# EAGLE design Stirplate (EAGLE 9.6.2)
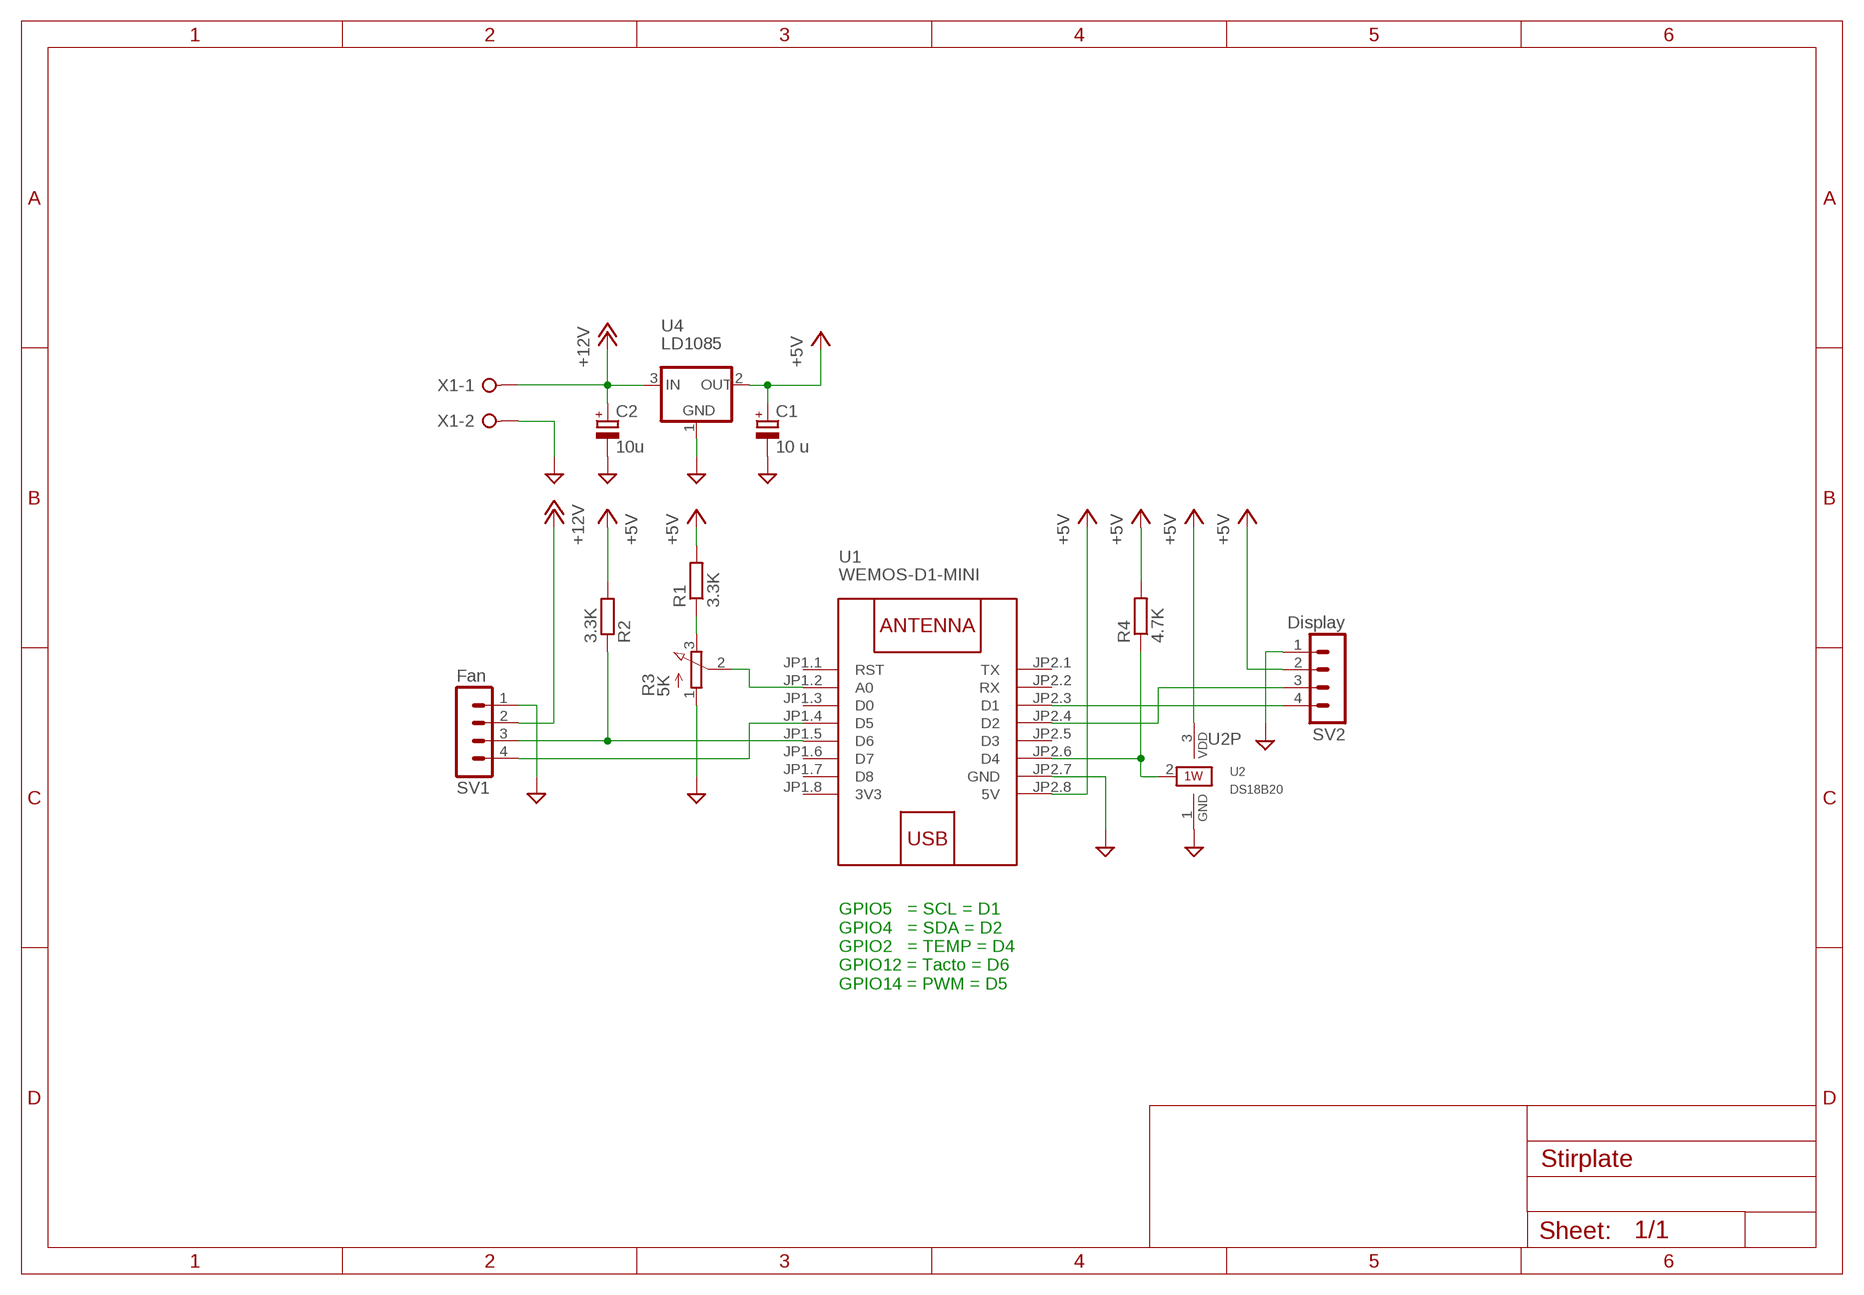
[diagram p0: schematic, sheet 1]

## Parts
C1  10 u  CPOL-EUE2.5-5  [E2,5-5]
C2  10u  CPOL-EUE2.5-5  [E2,5-5]
R1  3.3K  R-EU_0207/10  [0207/10]
R2  3.3K  R-EU_0207/10  [0207/10]
R3  5K  3RP/1610N  [3RP/1610N]
R4  4.7K  R-EU_0207/10  [0207/10]
SV1  Fan  MA04-1  [MA04-1]
SV2  Display  MA04-1  [MA04-1]
U1  WEMOS-D1-MINI  [WEMOS-D1-MINI]
U2  DS18B20  [TO92-]
U4  PMX42_LD1086VXX-H  [PMX42_TO220-NH]
X1  W237-02P  [W237-132]

## Nets
1W: R4.1 U1.JP2.6(D4) U2.2(1W)
+5V: C1.+ R1.2 R2.2 R4.2 SV2.2 U1.JP2.8(5V) U2.3(VDD) U4.2(OUT)
+12V: C2.+ SV1.2 U4.3(IN) X1.1
GND: C1.- C2.- R3.1(A) SV1.1 SV2.1 U1.JP2.7(GND) U2.1(GND) U4.1(GND) X1.2
N$1: R3.2(S) U1.JP1.2(A0)
N$2: R1.1 R3.3(E)
N$4: R2.1 SV1.3 U1.JP1.5(D6)
N$5: SV1.4 U1.JP1.4(D5)
N$8: SV2.3 U1.JP2.4(D2)
N$9: SV2.4 U1.JP2.3(D1)
Unconnected: U1.JP1.1(RST) U1.JP1.3(D0) U1.JP1.6(D7) U1.JP1.7(D8) U1.JP2.1(TX) U1.JP2.2(RX) U1.JP2.5(D3)

## Notes on the sheet
- GPIO5   = SCL = D1
  GPIO4   = SDA = D2
  GPIO2   = TEMP = D4
  GPIO12 = Tacto = D6
  GPIO14 = PWM = D5

## Power pins joined to a net without a drawn wire
3V3: U1.JP1.8(3V3)

## Library data of the parts
C1 C2 = rcl:CPOL-EU: POLARIZED CAPACITOR, European symbol
R1 R2 R4 = rcl:R-EU_: RESISTOR, European symbol
R3 = pot:3RP/1610N: 16mm Potentiometer one level Source: http://www.alphapotentiometers.net/html/16mm_pot_2.html
SV1 SV2 = con-lstb:MA04-1: PIN HEADER; OC_FARNELL: unknown; OC_NEWARK: unknown
U1 = diy-modules:WEMOS-D1-MINI: WEMOS D1 mini: Mini Wi-Fi Board based on ESP-8266 device More details can be found here: https://www.wemos.cc/product/d1-mini.html Click here to find device on ebay.com <http://www.ebay.com/sch/wemos+d1+mini+nodemcu>
U2 = 1wire:DS18B20: Programmable Resolution Digital Thermometer This chip provides a onewire thermosensor with approx. 0.5°C accuracy. A programmable over/undertemperure alarm is available. The precision can be set from 9..12 bits. Notes: Vdd must be applied for accurate measurements at low temperatures, as the parasite power circuit otherwise heats the sensor. If parasite power is used, Vdd has to be connected to GND. The DS1822 is a low-cost thermometer chip, the DS18S20 is similar to the DS18B20, but with 9 Bit precision only. Author: Jan Kandziora <jjj@gmx.de>
U4 = LinkedLibrary52101:PMX42_LD1086: LDO Regulator LD1086 series; ID: LD1085
X1 = con-wago-508:W237-02P: WAGO SREW CLAMP; OC_FARNELL: unknown; OC_NEWARK: unknown

## Board
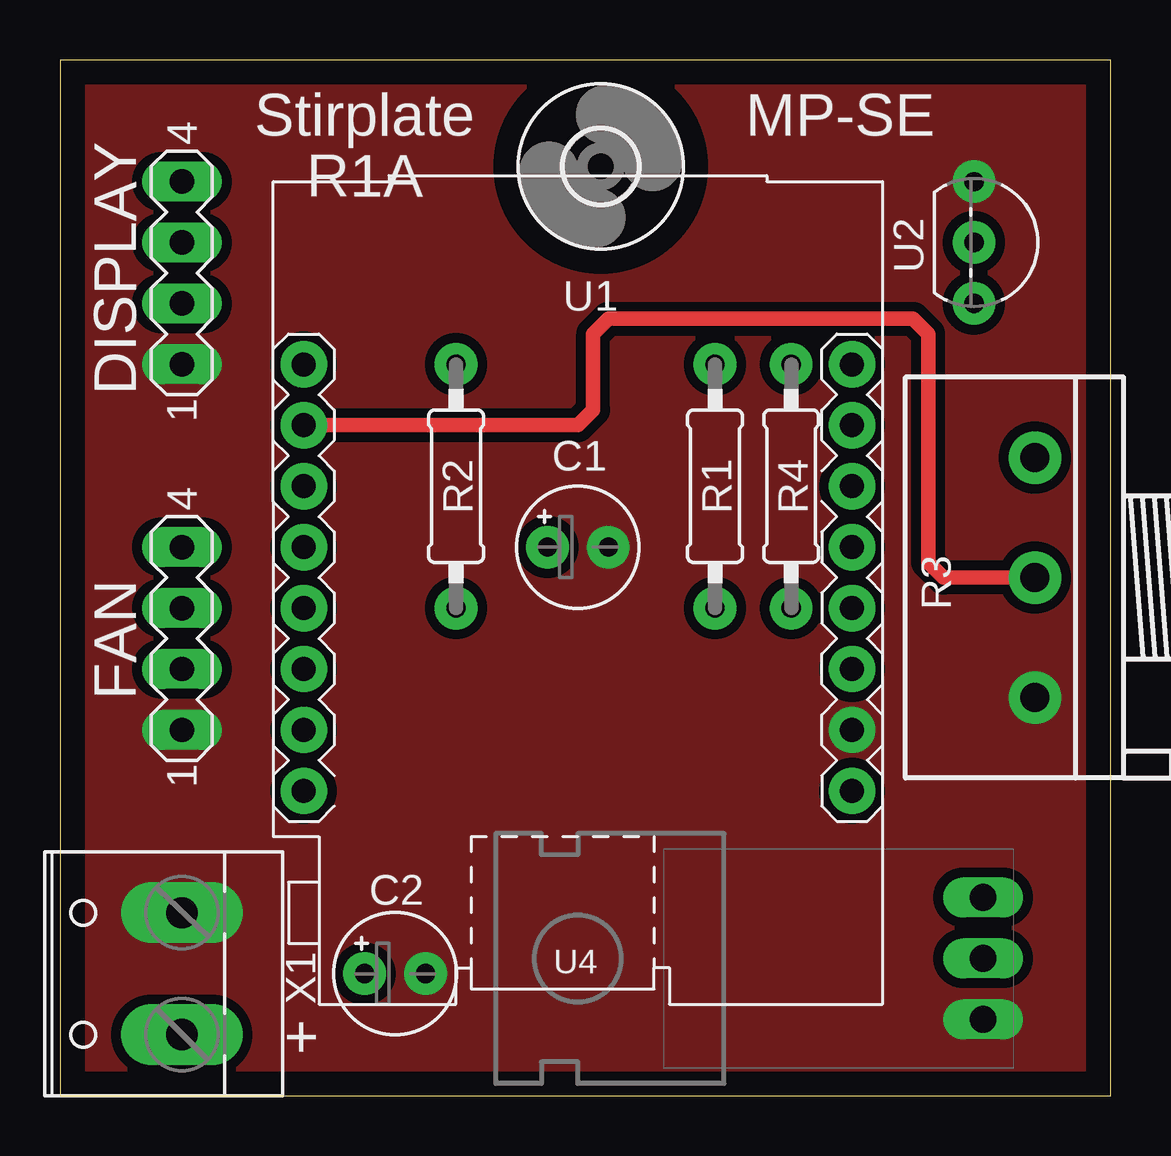
[diagram p1: board, top side]
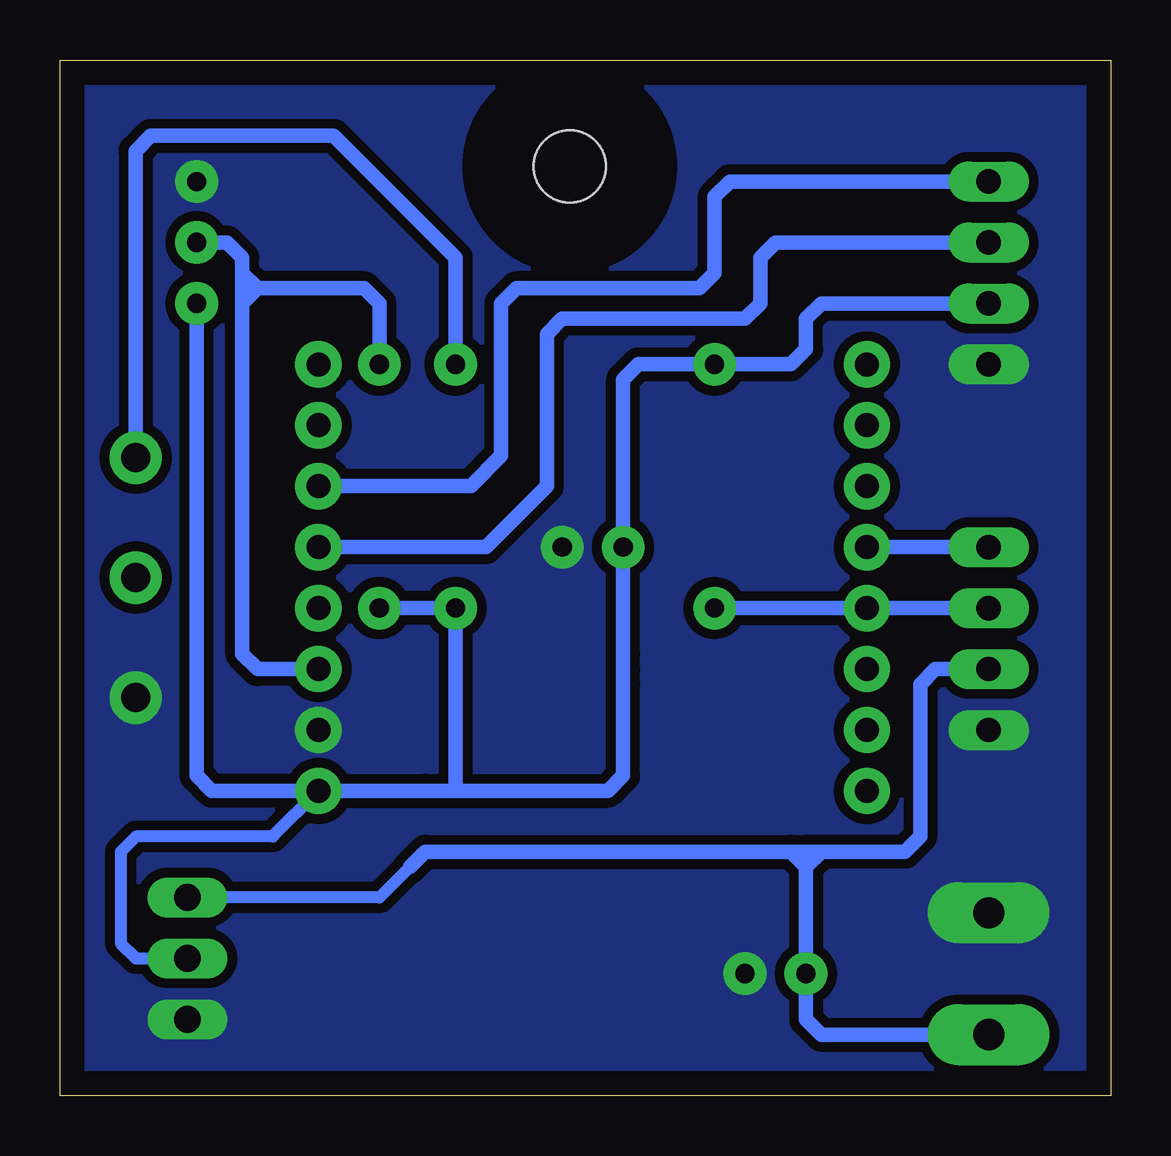
[diagram p2: board, bottom side, seen from below]

Size 43.8 x 43.17 mm. Coordinates in mm from the lower left corner, seen from the top.
Outline: 0,0 43.8,0 43.8,43.17 0,43.17 0,0
Copper layers (1*16): Top 0.035mm / dielectric 1.5mm / Bottom 0.035mm
Design rules "default": minimum track width 10mil, minimum drill 24mil, track to track 8mil, track to pad 8mil, pad to pad 8mil, via to via 8mil, smd to smd 8mil, copper to edge 40mil, drill to drill 8mil, minimum pad ring 10mil, minimum via ring 8mil, stop-mask expansion 4mil, vias tented up to drill 0mil, thermal gap 10mil

### Footprints (pad centres in the part's own frame; a part is rotated, then mirrored left to right if it is on the bottom)
E2,5-5 = drill 0.8 pad 1.778: + -1.27,0; - 1.27,0
0207/10 = drill 0.8 pad 1.778: 1 -5.08,0; 2 5.08,0
3RP/1610N = drill 1.2 pad 2.184: 1 -5,0; 2 0,0; 3 5,0
MA04-1 = drill 1.016 pad 1.676 long: 1 -3.81,0; 2 -1.27,0; 3 1.27,0; 4 3.81,0
WEMOS-D1-MINI = drill 1 pad 1.93: JP1.1 -11.43,9.525; JP1.2 -11.43,6.985; JP1.3 -11.43,4.445; JP1.4 -11.43,1.905; JP1.5 -11.43,-0.635; JP1.6 -11.43,-3.175; JP1.7 -11.43,-5.715; JP1.8 -11.43,-8.255; JP2.1 11.43,9.525; JP2.2 11.43,6.985; JP2.3 11.43,4.445; JP2.4 11.43,1.905; JP2.5 11.43,-0.635; JP2.6 11.43,-3.175; JP2.7 11.43,-5.715; JP2.8 11.43,-8.255
TO92- = drill 0.8 pad 1.778: 1 -2.54,0; 2 0,0; 3 2.54,0
PMX42_TO220-NH = drill 1.118 long: 1 -2.54,-16.891; 2 0,-16.891; 3 2.54,-16.891
3,0 = hole 3: 0,0
W237-132 = drill 1.3 pad 2.54 long: 1 -2.54,0; 2 2.54,0

### Placement (x,y rotation side)
C1  21.59,22.86 0 top
C2  13.97,5.08 0 top
R1  27.3,25.4 270 top
R2  16.51,25.4 90 top
R3  40.64,21.59 90 top
R4  30.48,25.4 270 top
SV1  5.08,19.05 90 top
SV2  5.08,34.29 90 top
U1  21.59,20.95 0 top
U2  38.1,35.56 270 top
U4  21.59,5.71 90 top
U$3  [3,0]  22.54,38.73 0 top
X1  5.08,5.08 90 top

### Tracks (layer width: path | path; a pad name or v marks a point on that pad's centre or on a via)
1W
  Bottom 0.61: U1.JP2.6 35.56,17.78 36.2,18.41 36.2,33.02 | 36.2,33.02 36.2,33.66 | 36.2,33.66 36.2,34.29 | 36.2,34.29 36.2,34.92 36.83,35.56 U2.2 | R4.1 30.48,33.02 31.11,33.66 35.56,33.66 | 35.56,33.66 36.2,33.66 | 35.56,33.66 36.2,34.29 | 36.2,33.02 35.56,33.66
+5V
  Bottom 0.508: U1.JP2.8 34.92,10.79 40.62,10.79 41.26,10.16 41.26,6.35 40.62,5.71 U4.2
  Bottom 0.61: 27.3,12.7 27.94,12.7 28.57,12.7 U1.JP2.8 37.47,12.7 38.1,13.34 U2.3 | 27.3,12.7 20.95,12.7 20.32,13.34 20.32,17.14 20.32,17.78 20.32,18.41 C1.+ 20.32,29.84 19.68,30.48 R2.2 13.34,30.48 12.7,31.11 12.7,32.38 12.06,33.02 SV2.2 | 27.3,12.7 R1.2 R4.2
+12V
  Bottom 0.508: 29.21,9.53 30.48,8.26 U4.3
  Bottom 0.61: X1.1 12.06,2.54 12.7,3.17 C2.+ 12.7,9.53 | SV1.2 7.3,17.78 7.94,17.14 7.94,10.79 8.57,10.16 12.06,10.16 | 12.06,10.16 12.7,10.16 | 12.7,10.16 12.7,9.53 | 29.21,9.53 28.57,10.16 13.34,10.16 | 13.34,10.16 12.7,10.16 | 12.06,10.16 12.7,9.53 | 12.7,9.53 13.34,10.16
GND
  pour Bottom (isolate 0.406, no thermals): 0,0 43.81,0 43.81,43.18 0,43.18
  pour Top (isolate 0.406, no thermals): 0,0 43.81,0 43.81,43.18 0,43.18
N$1
  Top 0.61: U1.JP1.2 21.59,27.94 22.23,28.57 22.23,31.75 22.86,32.38 35.56,32.38 36.2,31.75 36.2,22.23 36.83,21.59 R3.2
N$2
  Bottom 0.61: R3.3 40.64,39.37 40.01,40.01 32.38,40.01 27.3,34.92 R1.1
N$4
  Bottom 0.61: R2.1 U1.JP1.5 SV1.3
N$5
  Bottom 0.61: SV1.4 U1.JP1.4
N$8
  Bottom 0.61: U1.JP2.4 26.04,22.86 23.5,25.4 23.5,31.75 22.86,32.38 15.24,32.38 14.61,33.02 14.61,34.92 13.97,35.56 SV2.3
N$9
  Bottom 0.61: SV2.4 15.88,38.1 16.51,37.47 16.51,34.29 17.14,33.66 24.77,33.66 25.4,33.02 25.4,26.67 26.67,25.4 U1.JP2.3

### Text on the board
tNames: Stirplate | MP-SE | R1A | DISPLAY | FAN | +